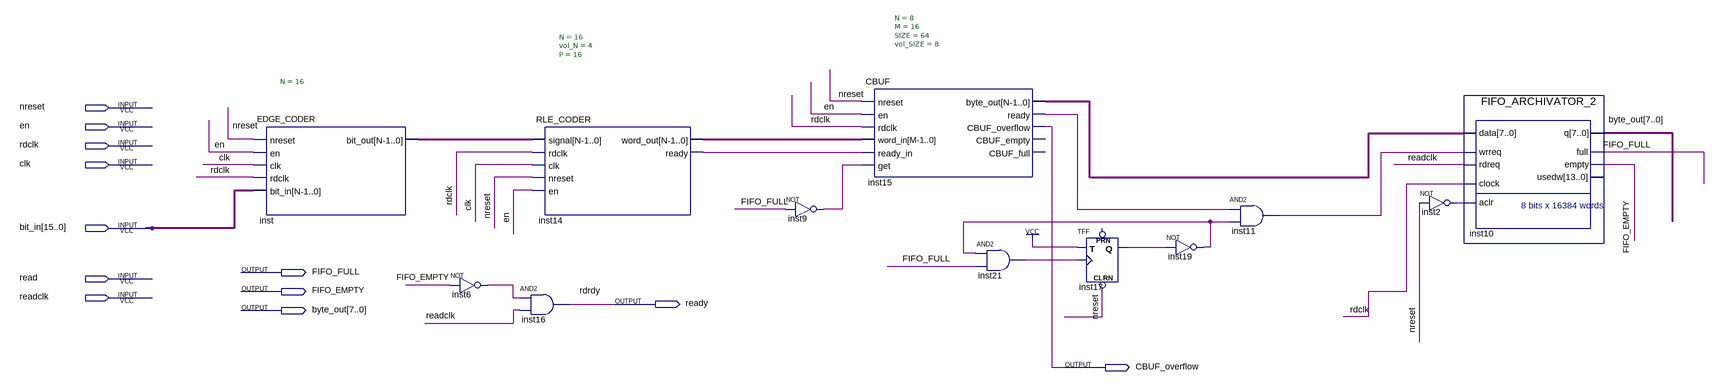
[diagram p0: schematic sheet]
// Quartus schematic ARCHIVATOR.bdf as structural Verilog: 12 symbols, 12 pins
module ARCHIVATOR (
  input  nreset,
  input  en,
  input  rdclk,
  input  clk,
  input  [15:0] bit_in,
  input  read,
  input  readclk,
  output FIFO_FULL,
  output FIFO_EMPTY,
  output ready,
  output [7:0] byte_out,
  output CBUF_overflow
);

  wire inst2_out, inst6_out, inst9_out, inst11_out, inst14_ready, inst15_ready, inst17_q, inst19_out,
       inst21_out;
  wire [7:0] inst15_byte_out;
  wire [15:0] inst14_word_out, inst_bit_out;

  EDGE_CODER #(.N(16)) inst (
    .nreset(nreset), .en(en), .clk(clk), .rdclk(rdclk), .bit_in(bit_in), .bit_out(inst_bit_out));
  not inst6 (inst6_out, FIFO_EMPTY);
  RLE_CODER #(.N(16), .vol_N(4), .P(16)) inst14 (
    .signal(inst_bit_out), .rdclk(rdclk), .clk(clk), .nreset(nreset), .en(en), .word_out(inst14_word_out),
    .ready(inst14_ready));
  and inst16 (ready, inst6_out, readclk);
  not inst9 (inst9_out, FIFO_FULL);
  CBUF #(.N(8), .M(16), .SIZE(64), .vol_SIZE(8)) inst15 (
    .nreset(nreset), .en(en), .rdclk(rdclk), .word_in(inst14_word_out), .ready_in(inst14_ready),
    .get(inst9_out), .byte_out(inst15_byte_out), .ready(inst15_ready), .CBUF_overflow(CBUF_overflow));  // open: CBUF_empty, CBUF_full
  and inst21 (inst21_out, inst19_out, FIFO_FULL);
  TFF inst17 (.CLRN(nreset), .T(1'b1), .CLK(inst21_out), .Q(inst17_q));  // open: PRN
  not inst19 (inst19_out, inst17_q);
  and inst11 (inst11_out, inst15_ready, inst19_out);
  not inst2 (inst2_out, nreset);
  FIFO_ARCHIVATOR_2 inst10 (
    .data(inst15_byte_out), .wrreq(inst11_out), .rdreq(readclk), .clock(rdclk), .aclr(inst2_out),
    .q(byte_out), .full(FIFO_FULL), .empty(FIFO_EMPTY));  // open: usedw

  // Other names for the same wires on the sheet: rdrdy = ready
endmodule
